# EAGLE design Rate Controller (EAGLE 6.4)

## Sheet 1 of 2
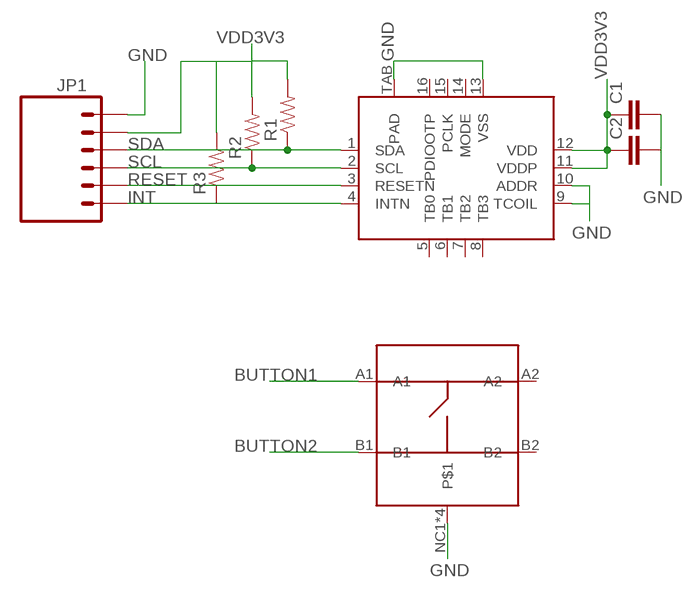
[diagram p0: schematic, sheet 1]

### Parts
C1  CAP0805  [0805]
C2  CAP0805  [0805]
JP1  M06DUAL_ROW  [2X03]
R1  RESISTOR0805-RES  [0805]
R2  RESISTOR0805-RES  [0805]
R3  RESISTOR0805-RES  [0805]
U$1  N50P105  [N50P105]
U$2  AC5013  [QFN16]

### Nets
BUTTON1: U$1.A1
BUTTON2: U$1.B1
GND: C1.2 C2.2 JP1.1 U$1.NC1 U$1.NC2 U$1.NC3 U$1.NC4 U$2.9(TCOIL) U$2.10(ADDR) U$2.13(VSS) U$2.TAB(PAD)
INT: JP1.6 R3.1 U$2.4(INTN)
RESET: JP1.5 U$2.3(RESETN)
SCL: JP1.4 R2.1 U$2.2(SCL)
SDA: JP1.3 R1.1 U$2.1(SDA)
VDD3V3: C1.1 C2.1 JP1.2 R1.2 R2.2 R3.2 U$2.11(VDDP) U$2.12(VDD)
Unconnected: U$1.A2 U$1.B2 U$2.5(TB0) U$2.6(TB1) U$2.7(TB2) U$2.8(TB3) U$2.14(MODE) U$2.15(PCLK) U$2.16(PDIOOTP)

## Sheet 2 of 2

## Library data of the parts
C1 C2 = ASL:CAP: Capacitor Standard 0603 ceramic capacitor, and 0.1" leaded capacitor.
JP1 = ASL:M06: Header 6 Standard 6-pin 0.1" header. Use with straight break away headers (SKU : PRT-00116), right angle break away headers (PRT-00553), swiss pins (PRT-00743), machine pins (PRT-00117), and female headers (PRT-00115). Molex polarized connector foot print use with SKU : PRT-08094 with associated crimp pins and housings. NOTES ON THE VARIANTS LOCK and LOCK_LONGPADS... This footprint was designed to help hold the alignment of a through-hole component (i.e. 6-pin header) while soldering it into place. You may notice that each hole has been shifted either up or down by 0.005 of an inch from it's more standard position (which is a perfectly straight line). This slight alteration caused the pins (the squares in the middle) to touch the edges of the holes. Because they are alternating, it causes a "brace" to hold the component in place. 0.005 has proven to be the perfect amount of "off-center" position when using our standard breakaway headers. Although looks a little odd when you look at the bare footprint, once you have a header in there, the alteration is very hard to notice. Also, if you push a header all the way into place, it is covered up entirely on the bottom side. This idea of altering the position of holes to aid alignment will be further integrated into the Sparkfun Library for other footprints. It can help hold any component with 3 or more connection pins.
R1-R3 = ASL:RESISTOR: Resistor Basic schematic elements and footprints for 0603, 1206, and PTH resistors.
U$1 = pavlo:N50P105
U$2 = pavlo:AC5013

## Board
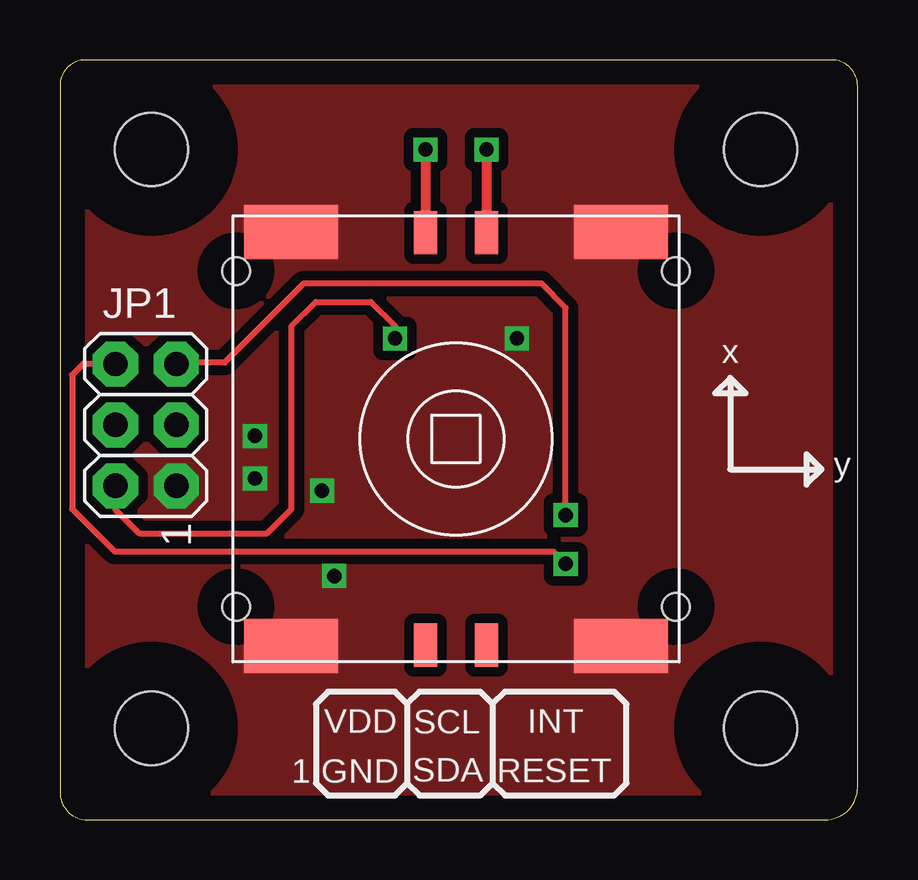
[diagram p1: board, top side]
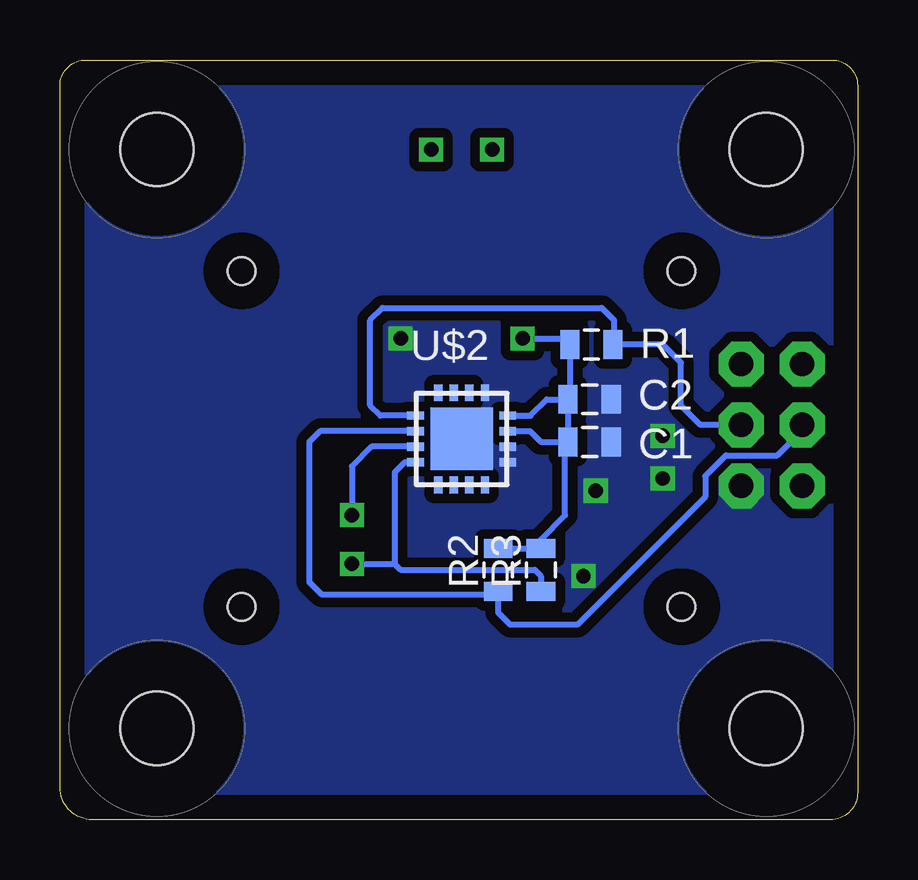
[diagram p2: board, bottom side, seen from below]

Size 33.25 x 31.67 mm. Coordinates in mm from the lower left corner, seen from the top.
Outline: 0,30.61 0,1.14 arc90 1.14,0 31.91,0 arc90 33.25,1.35 33.25,30.59 arc90 32.17,31.67 1.07,31.67 arc90 0,30.61
Copper layers (1*16): Top 0.035mm / dielectric 1.5mm / Bottom 0.035mm
Design rules "default": minimum track width 10mil, minimum drill 24mil, track to track 8mil, track to pad 8mil, pad to pad 8mil, via to via 8mil, smd to smd 8mil, copper to edge 40mil, drill to drill 8mil, minimum pad ring 10mil, minimum via ring 8mil, stop-mask expansion 4mil, vias tented up to drill 0mil, thermal gap 10mil

### Footprints (pad centres in the part's own frame; a part is rotated, then mirrored left to right if it is on the bottom)
0805 = smd 0.8 x 1.2: 1 -0.9,0; 2 0.9,0
STAND-OFF-TIGHT = hole 3.048: 0,0
2X03 = drill 1.016 pad 1.88 octagon: 1 -2.54,-1.27; 2 -2.54,1.27; 3 0,-1.27; 4 0,1.27; 5 2.54,-1.27; 6 2.54,1.27
N50P105 = smd 0.95 x 1.8: A1 -1.27,8.6; A2 -1.27,-8.6; B1 1.27,8.6; B2 1.27,-8.6 | smd 3.9 x 2.25: NC1 -6.875,8.63; NC2 6.875,8.63; NC3 -6.875,-8.63; NC4 6.875,-8.63 | hole 1.15: -9.17,7; 9.17,7; 9.17,-7; -9.17,-7
QFN16 = smd 0.7 x 0.35: 1 -1.925,0.975; 2 -1.925,0.325; 3 -1.925,-0.325; 4 -1.925,-0.975; 9 1.925,-0.975; 10 1.925,-0.325; 11 1.925,0.325; 12 1.925,0.975 | smd 0.35 x 0.7: 5 -0.975,-1.925; 6 -0.325,-1.925; 7 0.325,-1.925; 8 0.975,-1.925; 13 0.975,1.925; 14 0.325,1.925; 15 -0.325,1.925; 16 -0.975,1.925 | smd 2.6 x 2.6: TAB 0,0

### Placement (x,y rotation side)
C1  11.18,15.75 0 bottom
C2  11.18,17.53 0 bottom
E$1  [STAND-OFF-TIGHT]  3.81,3.81 0 top
E$2  [STAND-OFF-TIGHT]  3.81,27.94 0 top
E$3  [STAND-OFF-TIGHT]  29.21,27.94 0 top
E$4  [STAND-OFF-TIGHT]  29.21,3.81 0 top
JP1  3.58,16.46 90 top
R1  11.1,19.81 180 bottom
R2  14.99,10.41 90 bottom
R3  13.21,10.41 90 bottom
U$1  16.51,15.88 0 top
U$2  16.51,15.88 0 bottom

### Tracks (layer width: path | path; a pad name or v marks a point on that pad's centre or on a via)
BUTTON1  (via drill 0.6)
  Top 0.406: v15.24,27.94 U$1.A1
BUTTON2  (via drill 0.6)
  Top 0.406: v17.78,27.94 U$1.B1
GND  (via drill 0.6)
  other vias: 10.92,13.72 19.05,20.07 8.13,16 8.13,14.22 11.43,10.16
  pour Top (isolate 0.406, no thermals): 0,31.75 33.27,31.75 33.27,0 0,0
  pour Bottom (isolate 0.406, no thermals): 0,31.75 33.27,31.75 33.27,0 0,0
INT  (via drill 0.6)
  Top 0.254: JP1.6 0.96,19 0.51,18.54 0.51,12.95 2.29,11.18 20.57,11.18 v21.08,10.67
  Bottom 0.254: U$2.4 18.88,14.9 19.3,14.48 19.3,10.67 | 19.3,10.67 19.05,10.41 13.46,10.41 13.21,10.16 R3.1 | v21.08,10.67 19.3,10.67
RESET  (via drill 0.6)
  Top 0.254: v21.08,12.7 21.08,21.34 20.07,22.35 10.16,22.35 6.86,19.05 4.9,19.05 JP1.5
  Bottom 0.254: U$2.3 20.26,15.55 21.08,14.73 v21.08,12.7
SCL
  Bottom 0.254: U$2.2 22.41,16.2 22.86,15.75 22.86,9.91 22.35,9.4 15.1,9.4 R2.1 14.99,8.64 14.48,8.13 11.68,8.13 6.35,13.46 6.35,14.33 5.49,15.19 3.35,15.19 2.67,15.88 2.67,16.1 JP1.4
SDA
  Bottom 0.254: U$2.1 19.9,16.85 20.32,17.27 20.32,20.83 19.81,21.34 10.67,21.34 10.16,20.83 10.16,19.85 R1.1 8.13,19.81 7.37,19.05 7.37,17.27 6.55,16.46 JP1.3
VDD3V3  (via drill 0.6)
  Top 0.254: JP1.2 2.31,12.93 3.3,11.94 8.64,11.94 9.65,12.95 9.65,20.57 10.67,21.59 12.95,21.59 13.97,20.57 v13.97,20.07
  Bottom 0.254: U$2.12 13.63,16.85 12.95,17.53 C2.1 | U$2.11 13.66,16.2 13.21,15.75 C1.1 | 11.94,17.66 C2.1 | C2.1 C1.1 | C1.1 12.19,15.63 12.19,12.7 13.21,11.68 R3.2 R2.2 | C2.1 12,17.6 R1.2 12.25,20.07 v13.97,20.07

### Text on the board
tNames: x | y | VDD | SCL | INT | GND | SDA | RESET | 1